# EAGLE design Amazing All-Band Receiver (EAGLE 7.7.0)
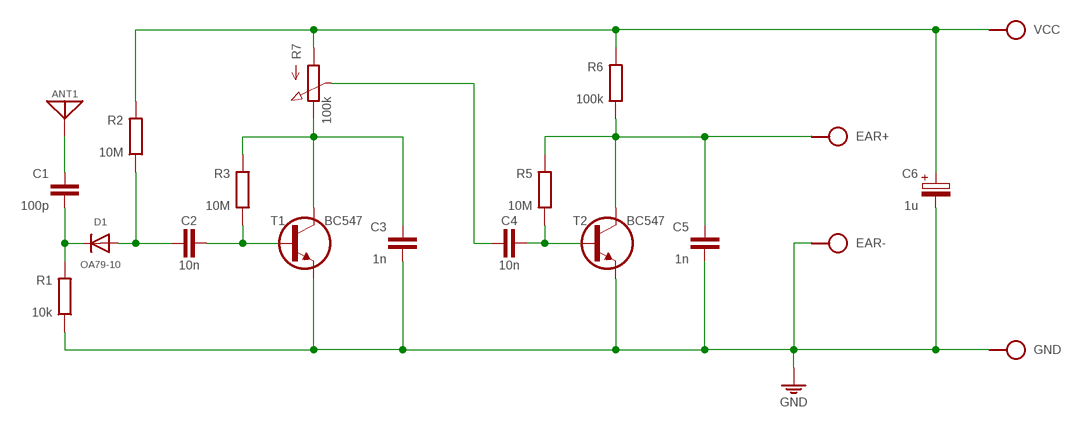
[diagram p0: schematic, sheet 1]

## Parts
ANT1  ANT  [SPAD]
C1  100p  C050-020X036/V  [C050-020X036/V]
C2  10n  C050-025X075  [C050-025X075]
C3  1n  C050-025X075  [C050-025X075]
C4  10n  C050-025X075  [C050-025X075]
C5  1n  C050-025X075  [C050-025X075]
C6  1u  CPOLE2,5-3  [E2,5-3]
D1  OA79-10  1N414834-7V  [DO34-7V]
EAR+  SPAD  [SPAD]
EAR-  SPAD  [SPAD]
GND  SPAD  [SPAD]
R1  10k  R0202/7-V  [0202/7-V]
R2  10M  R0202/7  [0202/7]
R3  10M  R0202/7-V  [0202/7-V]
R5  10M  R0202/7-V  [0202/7-V]
R6  100k  R0202/7-V  [0202/7-V]
R7  100k  POT  [POT]
T1  BC547  BC547CBE  [TO92-CBE]
T2  BC547  BC547CBE  [TO92-CBE]
VCC  SPAD  [SPAD]

## Nets
AC: C1.2 D1.C R1.2
ANT: ANT1.1 C1.1
DC: C2.2 D1.A R2.1
GND: C3.2 C5.2 C6.- EAR-.1 GND.1 R1.1 T1.E T2.E
I1: C2.1 R3.1 T1.B
I2: C4.1 R5.1 T2.B
O1: C3.1 R3.2 R7.3(E) T1.C
O2: C5.1 EAR+.1 R5.2 R6.1 T2.C
VCC: C6.+ R2.2 R6.2 R7.1(A) VCC.1
VO1: C4.2 R7.2(S)

## Library data of the parts
ANT1 = pad:ANT
C1-C5 = c:C: CAPACITOR, European symbol
C6 = c:CPOL: POLARIZED CAPACITOR, European symbol
D1 = d:1N4148
EAR+ EAR- GND VCC = pad:SPAD
R1-R3 R5 R6 = r:R: RESISTOR, European symbol
R7 = r:POT
T1 T2 = t:BC547

## Board
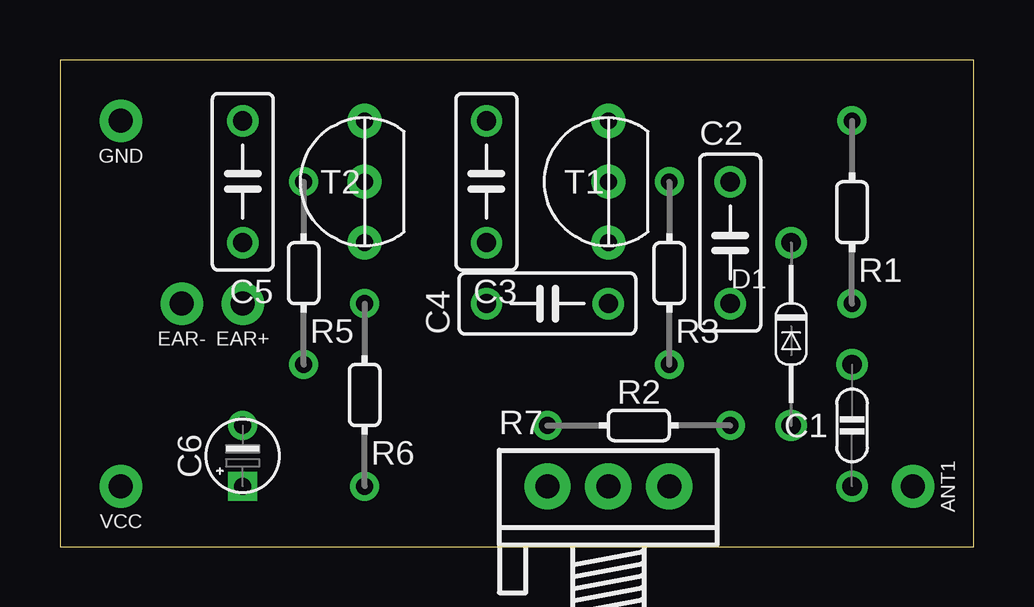
[diagram p1: board, top side]
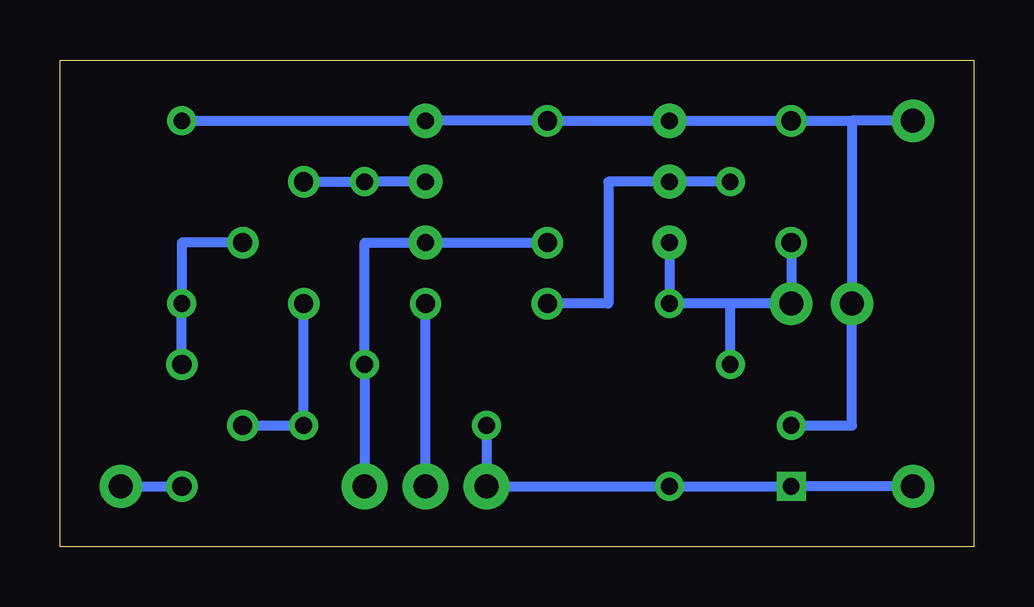
[diagram p2: board, bottom side, seen from below]

Size 38.1 x 20.31 mm. Coordinates in mm from the lower left corner, seen from the top.
Outline: 38.1,20.31 0,20.31 0,0 38.1,0 38.1,20.31
Copper layers (1*16): Top 0.035mm / dielectric 1.5mm / Bottom 0.035mm
Design rules "default": minimum track width 10mil, minimum drill 24mil, track to track 8mil, track to pad 8mil, pad to pad 8mil, via to via 8mil, smd to smd 8mil, copper to edge 40mil, drill to drill 8mil, minimum pad ring 10mil, minimum via ring 8mil, stop-mask expansion 4mil, vias tented up to drill 0mil, thermal gap 10mil

### Footprints (pad centres in the part's own frame; a part is rotated, then mirrored left to right if it is on the bottom)
SPAD = drill 1 pad 1.778: 1 0,0
C050-020X036/V = drill 0.8: 1 0,-2.54; 2 0,2.54
C050-025X075 = drill 0.8: 1 2.54,0; 2 -2.54,0
E2,5-3 = drill 0.7 square: + 0,1.27 | drill 0.7: - 0,-1.27
DO34-7V = drill 0.8: A 0,-3.81; C 0,3.81
0202/7-V = drill 0.7: 1 0,-3.81; 2 0,3.81
0202/7 = drill 0.7: 1 0,3.81; 2 0,-3.81
POT = drill 1 pad 1.93: 1 -2.54,0; 2 0,0; 3 2.54,0
TO92-CBE = drill 0.7 pad 1.422: B 0,0; C 0,2.54; E 0,-2.54

### Placement (x,y rotation side)
ANT1  35.56,2.53 180 top
C1  33.02,5.07 0 top
C2  27.94,12.69 90 top
C3  17.78,15.23 270 top
C4  20.32,10.15 180 top
C5  7.62,15.23 270 top
C6  7.62,3.8 180 top
D1  OA79  [DO34-7V]  30.48,8.88 0 top
EAR+  7.62,10.15 90 top
EAR-  5.08,10.15 90 top
GND  2.54,17.77 90 top
R1  33.02,13.96 180 top
R2  24.13,5.07 270 top
R3  25.4,11.42 180 top
R5  10.16,11.42 180 top
R6  12.7,6.34 180 top
R7  22.86,2.53 0 top
T1  22.86,15.23 180 top
T2  12.7,15.23 180 top
VCC  2.54,2.53 90 top

### Tracks (layer width: path | path; a pad name or v marks a point on that pad's centre or on a via)
AC
  Bottom 0.406: D1.C 33.02,12.69 R1.2 C1.2
ANT
  Bottom 0.406: ANT1.1 C1.1
DC
  Bottom 0.406: D1.A R2.1 C2.2
GND
  Bottom 0.406: R1.1 T1.E C3.2 T2.E C5.2 5.08,17.77 | GND.1 5.08,17.77 | C6.- 5.08,5.07 EAR-.1 5.08,17.77
I1
  Bottom 0.406: C2.1 R3.1 T1.B
I2
  Bottom 0.406: R5.1 T2.B 15.24,15.23 15.24,10.15 C4.1
O1
  Bottom 0.406: R7.3 R3.2 25.4,12.69 T1.C C3.1
O2
  Bottom 0.406: T2.C R6.1 10.16,10.15 | R5.2 10.16,10.15 | C5.1 EAR+.1 10.16,10.15
VCC
  Bottom 0.406: R2.2 R7.1 R6.2 C6.+ VCC.1
VO1
  Bottom 0.406: R7.2 C4.2